# EAGLE design control_rev5 (EAGLE 5.10)
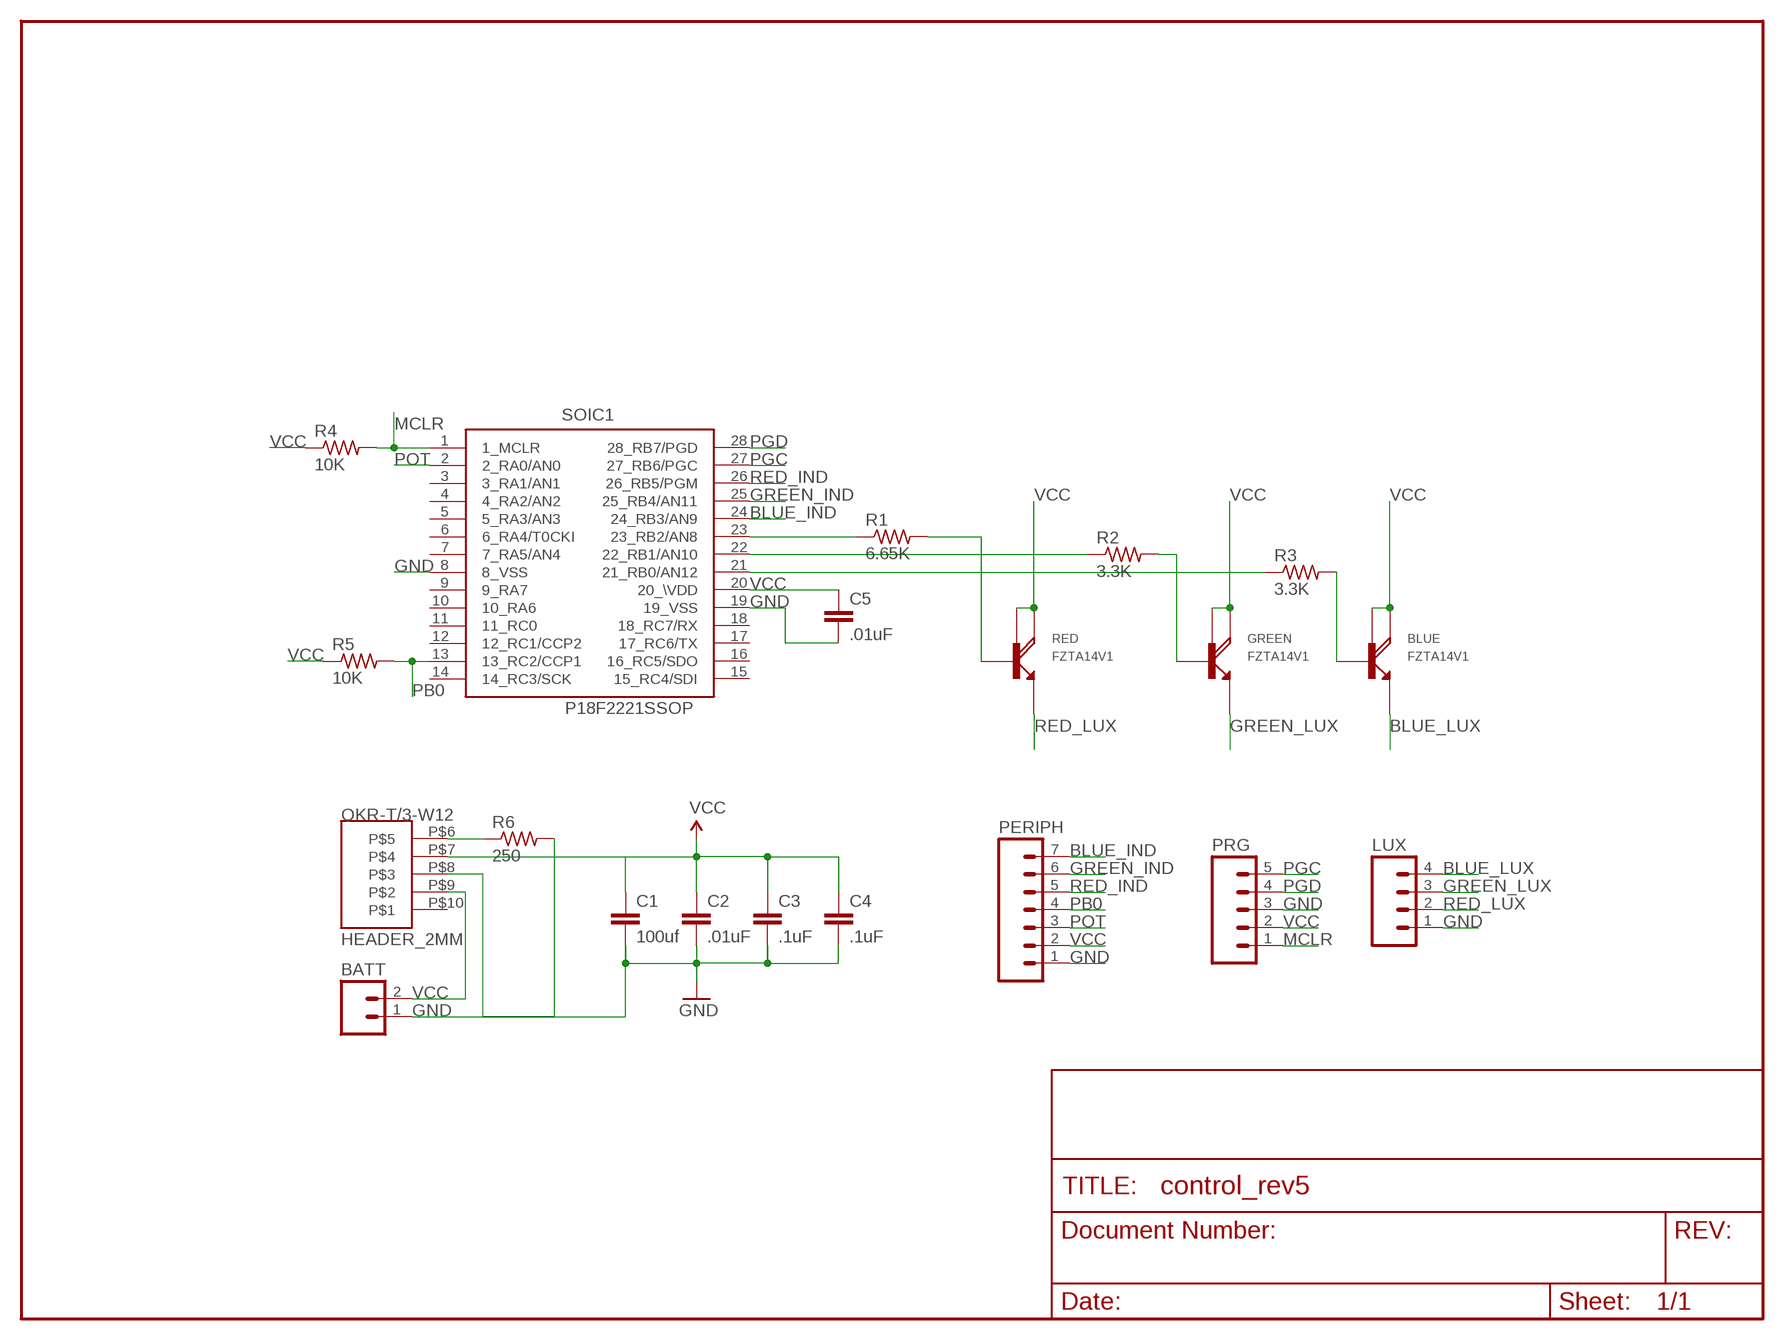
[diagram p0: schematic, sheet 1]

## Parts
BATT  M02PTH  [1X02]
BLUE  FZTA14V1  [SOT223]
C1  100uf  C5/7.2  [C5B7.2]
C2  .01uF  CAP0805  [0805]
C3  .1uF  CAP0805  [0805]
C4  .1uF  CAP0805  [0805]
C5  .01uF  CAP0805  [0805]
GREEN  FZTA14V1  [SOT223]
LUX  M04PTH  [1X04]
OKR-T/3-W12  HEADER_2MM  [HEADER2MM_5]
PERIPH  M07  [1X07]
PRG  M05PTH  [1X05]
R1  6.65K  R-US_M1206  [M1206]
R2  3.3K  R-US_M1206  [M1206]
R3  3.3K  R-US_M1206  [M1206]
R4  10K  R-US_M1206  [M1206]
R5  10K  R-US_M1206  [M1206]
R6  250  R-US_M1206  [M1206]
RED  FZTA14V1  [SOT223]
SOIC1  P18F2221SSOP  [SSOP-28]

## Nets
BLUE_IND: PERIPH.7 SOIC1.24(24_RB3/AN9)
BLUE_LUX: BLUE.EMIT(E) LUX.4
GND: BATT.1 C1.2 C2.2 C3.2 C4.2 C5.2 LUX.1 OKR-T/3-W12.P$8 PERIPH.1 PRG.3 R6.2 SOIC1.8(8_VSS) SOIC1.19(19_VSS)
GREEN_IND: PERIPH.6 SOIC1.25(25_RB4/AN11)
GREEN_LUX: GREEN.EMIT(E) LUX.3
MCLR: PRG.1 R4.2 SOIC1.1(1_MCLR)
N$4: R1.1 SOIC1.23(23_RB2/AN8)
N$5: R1.2 RED.BASE(B)
N$6: R2.1 SOIC1.22(22_RB1/AN10)
N$7: GREEN.BASE(B) R2.2
N$8: R3.1 SOIC1.21(21_RB0/AN12)
N$9: BLUE.BASE(B) R3.2
N$19: OKR-T/3-W12.P$6 R6.1
PB0: PERIPH.4 R5.2 SOIC1.13(13_RC2/CCP1)
PGC: PRG.5 SOIC1.27(27_RB6/PGC)
PGD: PRG.4 SOIC1.28(28_RB7/PGD)
POT: PERIPH.3 SOIC1.2(2_RA0/AN0)
PWR: BATT.2 OKR-T/3-W12.P$9
RED_IND: PERIPH.5 SOIC1.26(26_RB5/PGM)
RED_LUX: LUX.2 RED.EMIT(E)
VCC: BLUE.COLL(C) BLUE.HEAT(C2) C1.1 C2.1 C3.1 C4.1 C5.1 GREEN.COLL(C) GREEN.HEAT(C2) OKR-T/3-W12.P$7 PERIPH.2 PRG.2 R4.1 R5.1 RED.COLL(C) RED.HEAT(C2) SOIC1.20(20_\VDD)
Unconnected: OKR-T/3-W12.P$10 SOIC1.3(3_RA1/AN1) SOIC1.4(4_RA2/AN2) SOIC1.5(5_RA3/AN3) SOIC1.6(6_RA4/T0CKI) SOIC1.7(7_RA5/AN4) SOIC1.9(9_RA7) SOIC1.10(10_RA6) SOIC1.11(11_RC0) SOIC1.12(12_RC1/CCP2) SOIC1.14(14_RC3/SCK) SOIC1.15(15_RC4/SDI) SOIC1.16(16_RC5/SDO) SOIC1.17(17_RC6/TX) SOIC1.18(18_RC7/RX)

## Library data of the parts
BATT = SparkFun:M02: Header 2 Standard 2-pin 0.1" header. Use with straight break away headers (SKU : PRT-00116), right angle break away headers (PRT-00553), swiss pins (PRT-00743), machine pins (PRT-00117), and female headers (PRT-00115). Molex polarized connector foot print use with SKU : PRT-08233 with associated crimp pins and housings.
BLUE GREEN RED = purduecer:FZTA14: NPN Darlington Transistor
C1 = capacitor-wima:C: CAPACITOR naming: grid - package width
C2-C5 = SparkFun:CAP: Capacitor Standard 0603 ceramic capacitor, and 0.1" leaded capacitor.
LUX = SparkFun:M04: Header 4 Standard 4-pin 0.1" header. Use with straight break away headers (SKU : PRT-00116), right angle break away headers (PRT-00553), swiss pins (PRT-00743), machine pins (PRT-00117), and female headers (PRT-00115). Molex polarized connector foot print use with SKU : PRT-08231 with associated crimp pins and housings.
OKR-T/3-W12 = NBitWonder:HEADER_2MM: 5-pin Header w/ 2mm (NOT 2.54mm!) spacing
PERIPH = SparkFun:M07: Header 7 Standard 7-pin 0.1" header. Use with straight break away headers (SKU : PRT-00116), right angle break away headers (PRT-00553), swiss pins (PRT-00743), machine pins (PRT-00117), and female headers (PRT-00115). NOTES ON THE VARIANTS LOCK and LOCK_LONGPADS... This footprint was designed to help hold the alignment of a through-hole component (i.e. 7-pin header) while soldering it into place. You may notice that each hole has been shifted either up or down by 0.005 of an inch from it's more standard position (which is usually a perfectly straight line). This slight alteration caused the pins (the squares in the middle) to touch the edges of the holes. Because they are alternating, it causes a "brace" to hold the header in place. 0.005 has proven to be the perfect amount of "off-center" position when using our standard breakaway headers. Although looks a little odd when you look at the bare footprint, once you have a header in there, the alteration is very hard to notice. Also, if you push a header all the way into place, it is covered up entirely on the bottom side. This idea of altering the position of holes to aid alignment will be further integrated into the Sparkfun Library for other footprints. It can help hold any component with 3 or more connection pins.
PRG = SparkFun:M05: Header 5 Standard 5-pin 0.1" header. Use with straight break away headers (SKU : PRT-00116), right angle break away headers (PRT-00553), swiss pins (PRT-00743), machine pins (PRT-00117), and female headers (PRT-00115). Molex polarized connector foot print use with SKU : PRT-08230 with associated crimp pins and housings.
R1-R6 = resistor:R-US_: RESISTOR, American symbol
SOIC1 = purduecer:P18F2221: 28-pin PIC18F series Microcontroller

## Board
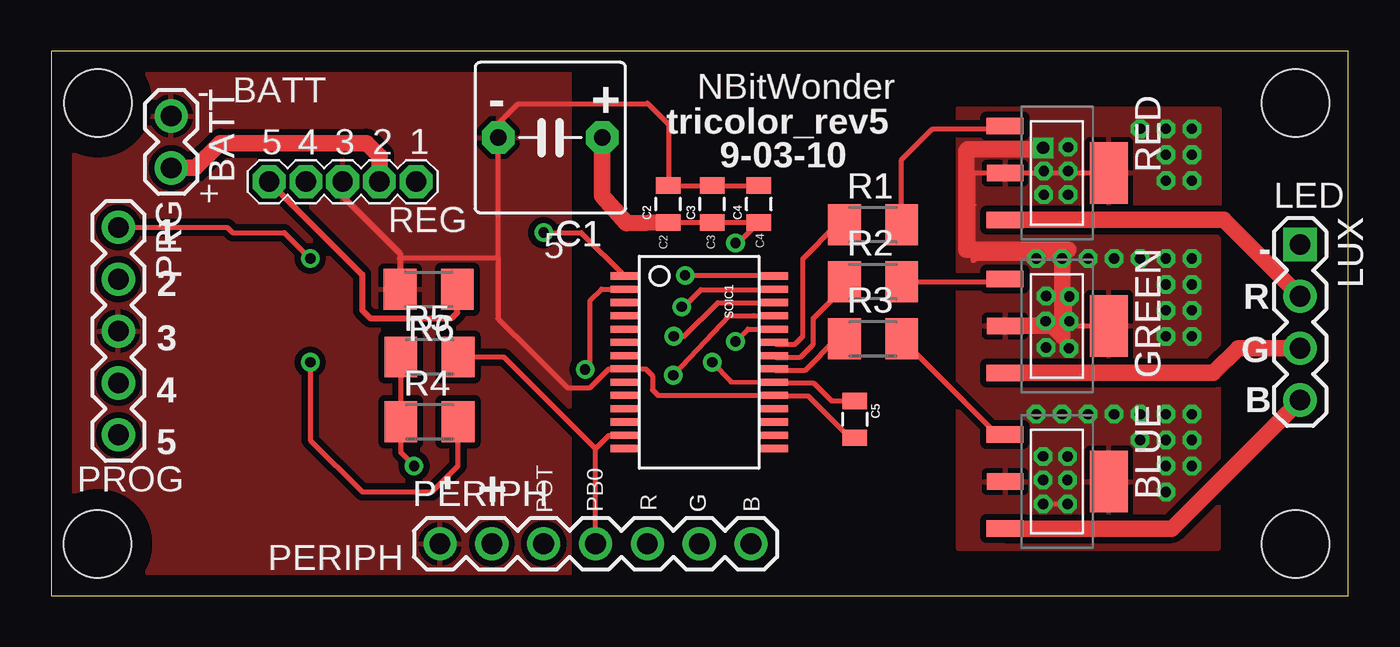
[diagram p1: board, top side]
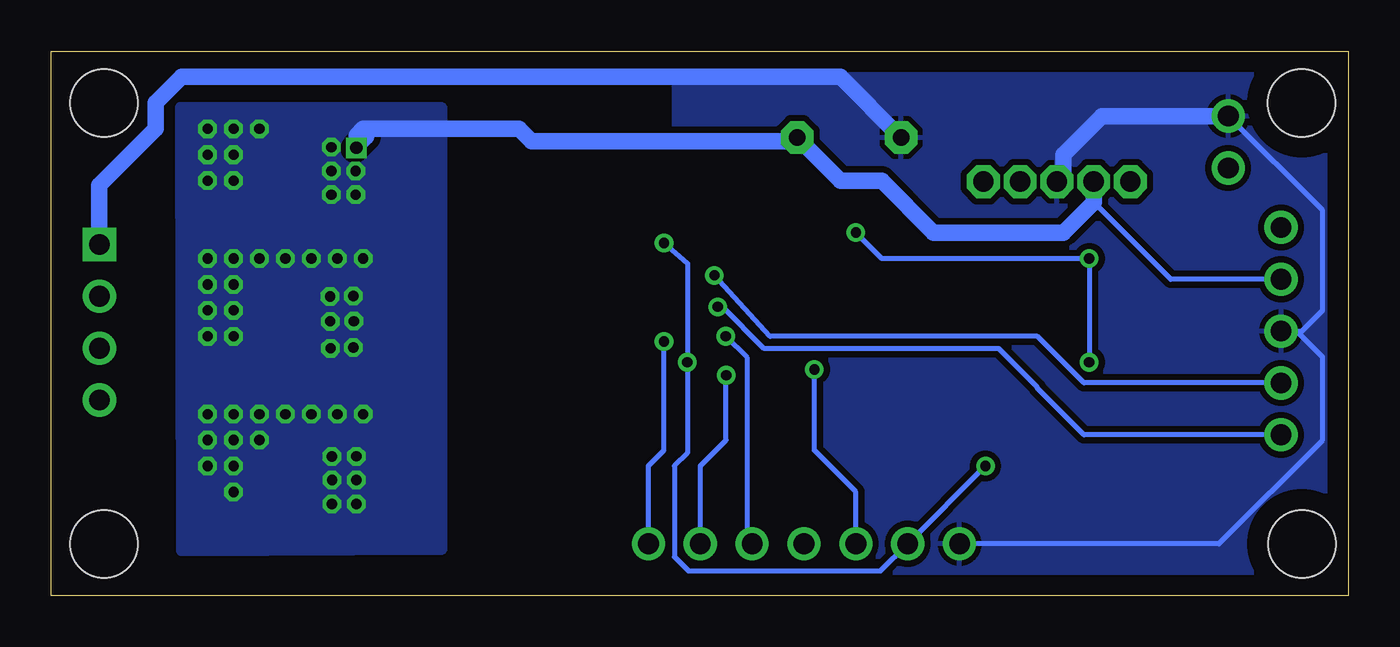
[diagram p2: board, bottom side, seen from below]

Size 63.55 x 26.67 mm. Coordinates in mm from the lower left corner, seen from the top.
Outline: 0,0 63.55,0 63.55,26.66 0,26.67 0,0
Copper layers (1*16): Top 0.035mm / dielectric 1.5mm / Bottom 0.035mm
Design rules "default *": minimum track width 10mil, minimum drill 24mil, track to track 8mil, track to pad 8mil, pad to pad 8mil, via to via 8mil, smd to smd 8mil, copper to edge 40mil, drill to drill 8mil, minimum pad ring 12mil, minimum via ring 8mil, stop-mask expansion 4mil, vias tented up to drill 20mil, thermal gap 10mil

### Footprints (pad centres in the part's own frame; a part is rotated, then mirrored left to right if it is on the bottom)
1X02 = drill 1.016 round: 1 0,0; 2 2.54,0
SOT223 = smd 0.8 x 1.8: BASE -2.3,-2.55; COLL 0,-2.54; EMIT 2.3,-2.55 | smd 3 x 1.85: HEAT 0,2.54
C5B7.2 = drill 0.813 pad 1.6 octagon: 1 -2.54,0; 2 2.54,0
0805 = smd 0.8 x 1.2: 1 -0.9,0; 2 0.9,0
1X04 = drill 1.016 square: 1 0,0 | drill 1.016 round: 2 2.54,0; 3 5.08,0; 4 7.62,0
HEADER2MM_5 = drill 1 octagon: P$6 0,0; P$7 1.8,0; P$8 3.6,0; P$9 5.4,0; P$10 7.2,0
1X07 = drill 1.016 round: 1 0,0; 2 2.54,0; 3 5.08,0; 4 7.62,0; 5 10.16,0; 6 12.7,0; 7 15.24,0
1X05 = drill 1.016 round: 1 0,0; 2 2.54,0; 3 5.08,0; 4 7.62,0; 5 10.16,0
M1206 = smd 1.6 x 2: 1 -1.4,0; 2 1.4,0
SSOP-28 = smd 0.348 x 1.397: 1 -4.225,-3.656; 2 -3.575,-3.656; 3 -2.925,-3.656; 4 -2.275,-3.656; 5 -1.625,-3.656; 6 -0.975,-3.656; 7 -0.325,-3.656; 8 0.325,-3.656; 9 0.975,-3.656; 10 1.625,-3.656; 11 2.275,-3.656; 12 2.925,-3.656; 13 3.575,-3.656; 14 4.225,-3.656; 15 4.225,3.656; 16 3.575,3.656; 17 2.925,3.656; 18 2.275,3.656; 19 1.625,3.656; 20 0.975,3.656; 21 0.325,3.656; 22 -0.325,3.656; 23 -0.975,3.656; 24 -1.625,3.656; 25 -2.275,3.656; 26 -2.925,3.656; 27 -3.575,3.656; 28 -4.225,3.656
STAND-OFF = hole 3.302: 0,0

### Placement (x,y rotation side)
BATT  5.89,23.49 270 top
BLUE  49.28,5.59 270 top
C1  24.46,22.43 180 top
C2  30.23,19.18 90 top
C3  32.38,19.18 90 top
C4  34.67,19.18 90 top
C5  39.37,8.64 270 top
GREEN  49.28,13.21 270 top
LUX  61.18,17.2 270 top
OKR-T/3-W12  10.68,20.28 0 top
PERIPH  19.05,2.54 0 top
PRG  3.3,18.04 270 top
R1  40.26,18.16 0 top
R2  40.26,15.37 0 top
R3  40.26,12.57 0 top
R4  18.54,8.51 0 top
R5  18.54,11.68 0 top
R6  18.49,15 180 top
RED  49.28,20.7 270 top
SOIC1  31.75,11.43 270 top
U$1  [STAND-OFF]  2.29,2.54 0 top
U$2  [STAND-OFF]  2.29,24.13 0 top
U$3  [STAND-OFF]  60.96,24.13 0 top
U$4  [STAND-OFF]  60.96,2.54 0 top

### Tracks (layer width: path | path; a pad name or v marks a point on that pad's centre or on a via)
BLUE_IND  (via drill 0.51)
  Top 0.254: SOIC1.24 34.14,13.06 v33.53,12.45
  Bottom 0.254: v33.53,12.45 33.53,7.11 34.29,6.35 PERIPH.7
BLUE_LUX
  Top 0.813: BLUE.EMIT 54.89,3.29 LUX.4
GND
  Top 0.254: C4.2 C3.2 C2.2 30.23,23.1 29.21,24.12 29.21,24.13 29.17,24.09 22.88,24.09 21.92,23.12 C1.2 21.89,22.4 21.89,16.54 | C5.2 39.13,7.74 37.08,9.78 35.43,9.78 SOIC1.19 30.37,9.81 29.73,9.81 29.46,10.08 29.46,10.77 29.13,11.1 SOIC1.8 27.33,11.11 26.4,10.18 25.29,10.18 22.75,12.73 22.72,12.73 21.89,13.56 21.89,16.54 | 21.89,16.54 21.9,16.55 17.13,16.55 17.09,16.51
  Top 0.305: OKR-T/3-W12.P$8 14.28,19.55 17.09,16.75 17.09,16.51 R6.2
  Bottom 0.254: 2.54,12.96 2.29,12.96 1.27,13.97 1.27,18.87 BATT.1 | 2.54,12.96 PRG.3 | 2.54,12.96 1.27,11.68 1.27,7.62 6.35,2.54 PERIPH.1
  Bottom 0.813: LUX.1 61.18,20.1 58.42,22.86 58.42,24.13 57.15,25.4 24.89,25.4 C1.2 | BATT.1 12.07,23.49 13.97,21.59 13.97,20.59 OKR-T/3-W12.P$8
  pour Bottom (isolate 0.305): 33.02,0 33.02,26.67 0,26.67 0,0
  pour Top (isolate 0.305): 25.4,0 25.4,26.67 0,26.67 0,0
GREEN_IND  (via drill 0.51)
  Top 0.254: v30.48,10.8 33.24,13.72 34.42,13.72 SOIC1.25
  Bottom 0.254: v30.48,10.8 30.48,7.62 31.75,6.35 PERIPH.6
GREEN_LUX
  Top 0.813: GREEN.EMIT 56.93,10.91 58.15,12.12 LUX.3
MCLR  (via drill 0.5)
  Top 0.254: 28.08,15.66 27.94,15.66 27.95,15.66 SOIC1.1 25.97,17.78 v24.13,17.78 | PRG.1 8.64,18.04 8.89,17.78 11.43,17.78 v12.7,16.51 | v12.7,11.43 12.7,7.62 15.24,5.08 18.66,5.08 19.94,6.36 R4.2
  Bottom 0.254: v24.13,17.78 22.86,16.51 v12.7,16.51 v12.7,11.43
N$1
  Bottom 0.813: 48.11,22.47 48.68,21.91
N$4
  Top 0.254: R1.1 38.48,18.16 36.83,16.51 36.83,12.7 36.45,12.32 35.49,12.32 SOIC1.23
N$5
  Top 0.254: R1.2 41.66,21.34 43.18,22.86 46.59,22.86 RED.BASE
N$6
  Top 0.254: R2.1 38.86,15.11 37.34,13.59 37.34,12.32 36.7,11.68 35.48,11.68 SOIC1.22
N$7
  Top 0.254: R2.2 46.59,15.37 GREEN.BASE
N$8
  Top 0.254: R3.1 38.48,12.57 36.96,11.05 35.46,11.05 SOIC1.21
N$9
  Top 0.254: BLUE.BASE 46.34,7.89 R3.2
N$19
  Top 0.305: R6.1 19.89,13.86 19.63,13.59 15.62,13.59 15.24,13.97 15.24,15.72 OKR-T/3-W12.P$6
PB0
  Top 0.254: PERIPH.4 26.67,7.2 | 26.67,7.2 27.32,7.85 SOIC1.13 | R5.2 22.19,11.68 26.67,7.2
PGC  (via drill 0.5)
  Top 0.254: v30.9,14.15 30.98,14.14 31.83,14.99 35.39,14.99 SOIC1.27
  Bottom 0.254: PRG.5 12.95,7.88 15.24,10.16 15.24,10.21 17.13,12.1 28.62,12.1 30.67,14.15 v30.9,14.15
PGD  (via drill 0.5)
  Top 0.254: v31.06,15.69 35.37,15.69 SOIC1.28
  Bottom 0.254: PRG.4 12.95,10.41 15.24,12.7 28.33,12.7 v31.06,15.69
POT  (via drill 0.5)
  Top 0.254: SOIC1.2 26.95,15.01 26.41,14.46 26.41,11.33 v26.16,11.08
  Bottom 0.254: v26.16,11.08 26.16,7.12 24.13,5.08 PERIPH.3
PWR
  Top 0.813: BATT.2 7.07,20.95 8.29,22.16 15.46,22.16 16.1,21.52 16.1,20.29 OKR-T/3-W12.P$9
RED_IND  (via drill 0.51)
  Top 0.254: SOIC1.26 32.66,14.36 30.99,12.69 30.52,12.69 v30.5,12.71
  Bottom 0.254: v30.5,12.71 | v30.5,12.71 29.45,11.65 29.45,2.78 PERIPH.5
RED_LUX
  Top 0.813: RED.EMIT 57.44,18.4 LUX.2
VCC  (via drill 0.5, 0.51, 0.6)
  Top 0.254: 49.29,13.21 GREEN.COLL 47.5,13.21 | 49.29,13.21 GREEN.HEAT | C5.1 38.22,9.54 37.34,10.41 35.45,10.41 SOIC1.20 33.3,10.47 v32.38,11.43 | RED.HEAT RED.COLL 45.19,20.7 45.19,19.14 45.17,19.14 45.17,16.41 45.27,16.51 v48.26,16.51 v49.53,16.51 v49.88,14.65 v49.87,13.43 49.29,13.21 | R5.1 R4.1 17.14,6.99 v17.78,6.35 | C2.1 C3.1 C4.1 33.67,17.27 v33.53,17.27 | BLUE.COLL 46.72,5.61 | v49.79,4.49 v48.6,4.49
  Top 0.813: C1.1 26.99,19.58 28.18,18.25 C2.1 | GREEN.COLL 49.02,13.21 49.53,12.7 v49.53,16.51 49.53,16.64 49.83,16.94 44.83,16.94 44.83,21.79 44.91,21.87 48.53,21.87 v48.59,21.93
  Bottom 0.254: v33.53,17.27 32.38,16.27 v32.38,11.43 32.38,6.99 33.02,6.35 33.02,1.9 32.33,1.22 22.91,1.22 PERIPH.2 v17.78,6.35 | PRG.2 8.71,15.49 12.48,19.27
  Bottom 0.813: OKR-T/3-W12.P$7 12.48,19.27 13.97,17.78 20.32,17.78 22.86,20.32 24.89,20.32 C1.1 27.17,22.26 40.01,22.26 40.61,22.86 48.26,22.86 48.59,22.53 v48.59,21.93
  other vias: 48.6,21.96 49.82,21.96 48.63,20.8 49.82,20.8 48.63,19.63 49.82,19.63 53.34,22.86 54.61,22.86 55.88,22.86 54.61,21.59 55.88,21.59 55.88,20.32 54.61,20.32 50.8,16.51 48.74,14.67 48.72,13.44 48.74,12.15 49.86,12.11 52.07,16.51 53.34,16.51 54.61,16.51 55.88,16.51 54.61,15.24 55.88,15.24 54.61,13.97 55.88,13.97 54.61,12.7 55.88,12.7 55.88,8.89 55.88,7.62 55.88,6.35 54.61,5.08 54.61,6.35 54.61,7.62 54.61,8.89 53.34,8.89 53.34,7.62 52.07,8.89 50.8,8.89 49.53,8.89 48.26,8.89 48.6,6.83 49.79,6.81 49.79,5.66 48.6,5.66
  pour Top (isolate 0.305): 44.45,2.29 44.45,23.88 57.2,23.84 57.15,2.29
  pour Bottom (isolate 0.305): 44.45,23.88 57.16,23.89 57.13,2.22 44.45,2.29

### Text on the board
tPlace: - | BATT | NBitWonder | - | + | tricolor_rev5 | 5 | 4 | 4 | 3 | 2 | 1 | 9-03-10 | LED | + | REG | - | 1 | 5 | 2 | R | G | 3 | B | 4 | 5 | - | + | PROG | POT | PB0 | R | G | G | B | PERIPH
_tNames: BATT | BATT | RED | RED | PRG | PRG | R1 | R1 | LUX | LUX | C1 | C1 | C2 | C2 | C3 | C3 | C4 | C4 | C2 | C3 | C4 | R2 | R2 | GREEN | GREEN | SOIC1 | SOIC1 | R6 | R6 | R3 | R3 | R5 | R5 | R4 | R4 | C5 | C5 | C5 | BLUE | BLUE | PERIPH | PERIPH